# EAGLE design laser-breakout (EAGLE 7.7.0)
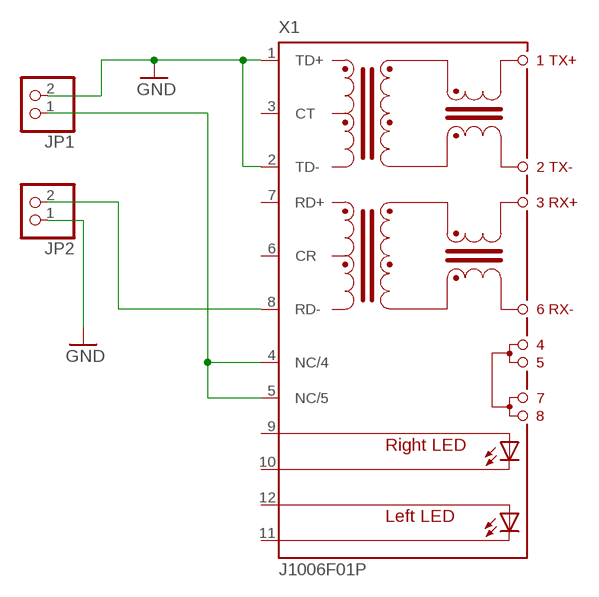
[diagram p0: schematic, sheet 1]

## Parts
JP1  PINHD-1X2  [1X02]
JP2  PINHD-1X2  [1X02]
X1  J1006F01P  [J1]

## Nets
12V: JP1.1 X1.4(NC/4) X1.5(NC/5)
GND: JP1.2 JP2.1 X1.1(TD+) X1.2(TD-)
TTL: JP2.2 X1.8(RD-)
Unconnected: X1.3(CT) X1.6(CR) X1.7(RD+) X1.9(A-R) X1.10(C-R) X1.11(C-L) X1.12(A-L)

## Library data of the parts
JP1 JP2 = pinhead:PINHD-1X2: PIN HEADER
X1 = con-pulse:J1006F01P: PULSEJACK (TM) 1x1 Tab-UP RJ45 10/100 Base-TX RJ45 1x1 Tab-UP with LEDs 8-pin (J1 series) and 6-pin (JP series) integrated magnetics connector, designed to support applications, such as ADSL modems, LAN-on-Motherboard, and Hub and Switches. Source: www.pulseeng.com .. PulseJack-J402.pdf; OC_FARNELL: unknown; OC_NEWARK: unknown

## Board
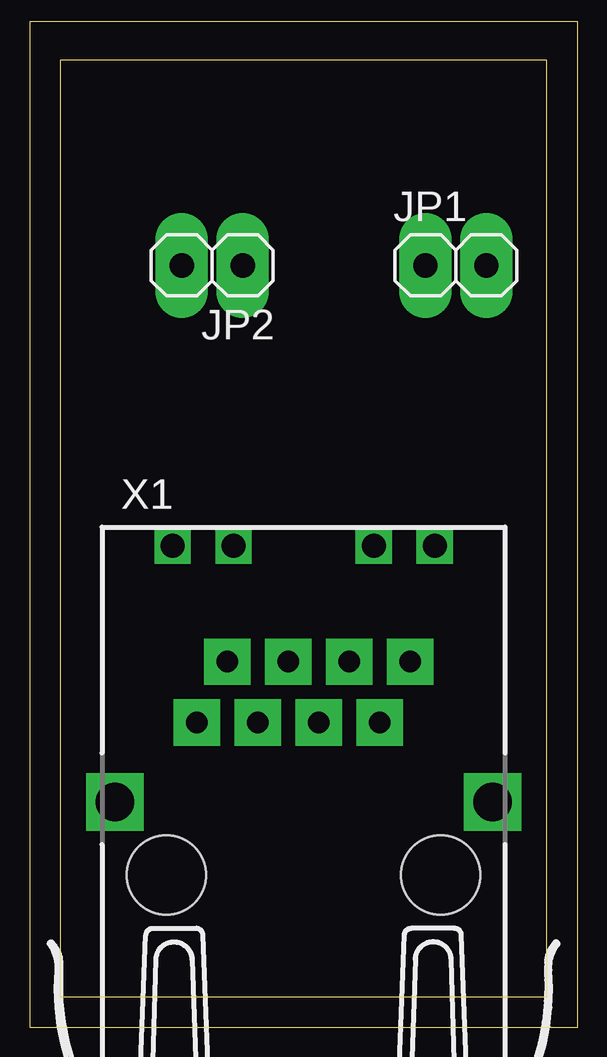
[diagram p1: board, top side]
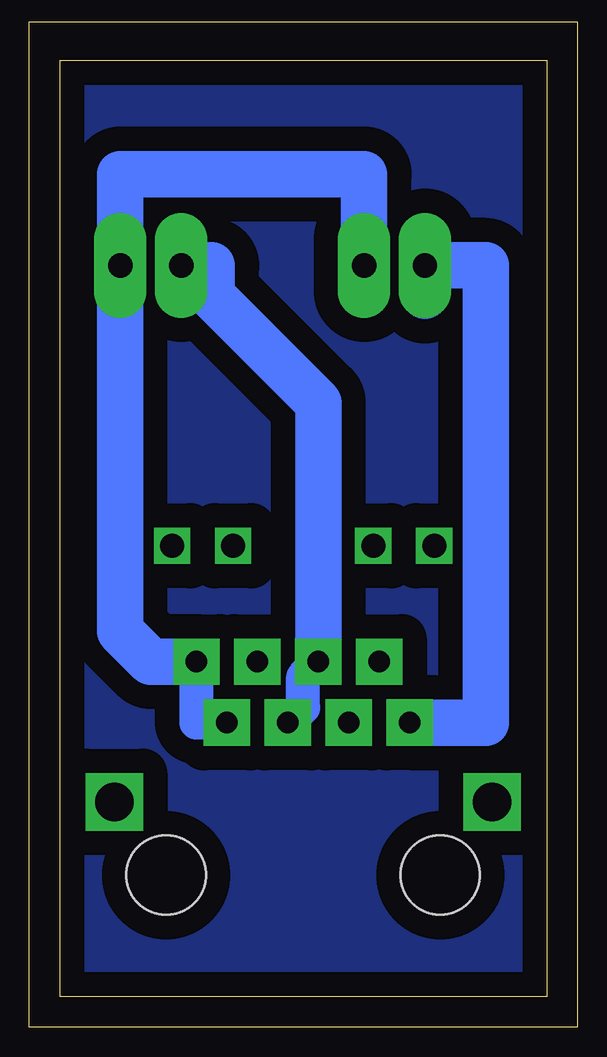
[diagram p2: board, bottom side, seen from below]

Size 20.3 x 39.04 mm. Coordinates in mm from the lower left corner, seen from the top.
Outline: 0,0 20.3,0 20.3,39.04 0,39.04 0,0
Copper layers (1*16): Top 0.035mm / dielectric 1.5mm / Bottom 0.035mm
Design rules "default": minimum track width 10mil, minimum drill 24mil, track to track 8mil, track to pad 8mil, pad to pad 8mil, via to via 8mil, smd to smd 8mil, copper to edge 40mil, drill to drill 8mil, minimum pad ring 10mil, minimum via ring 8mil, stop-mask expansion 4mil, vias tented up to drill 0mil, thermal gap 10mil
Milling: 4 lines

### Footprints (pad centres in the part's own frame; a part is rotated, then mirrored left to right if it is on the bottom)
1X02 = drill 1.016 pad 2.184 long: 1 -1.27,0; 2 1.27,0
J1 = drill 0.9 pad 1.93 square: 1 4.445,2.54; 2 3.175,0; 3 1.905,2.54; 4 0.635,0; 5 -0.635,2.54; 6 -1.905,0; 7 -3.175,2.54; 8 -4.445,0 | drill 1 pad 1.422 square: 9 5.465,7.37; 10 2.925,7.37; 11 -2.925,7.37; 12 -5.465,7.37 | drill 1.6 pad 2.184 square: M1 -7.875,-3.3; M2 7.875,-3.3 | hole 3.3: 5.715,-6.35; -5.715,-6.35

### Placement (x,y rotation side)
JP1  16.51,30.48 0 top
JP2  6.35,30.48 180 top
X1  10.16,11.43 0 top

### Tracks (layer width: path | path; a pad name or v marks a point on that pad's centre or on a via)
12V
  Bottom 1.422: X1.4 10.16,12.06 10.16,13.34 X1.5
  Bottom 1.93: X1.5 9.53,24.77 13.97,29.21 13.97,30.48 JP1.1
GND
  Bottom 1.422: X1.2 14.61,11.43 X1.1
  Bottom 1.93: JP2.1 7.62,34.29 17.78,34.29 JP1.2 17.78,15.24 16.51,13.97 X1.1
N$1
  pour Bottom (isolate 1.016): 0,39.37 0,0 20.32,0 20.32,39.37
TTL
  Bottom 1.93: X1.8 2.54,11.43 2.54,30.48 JP2.2 5.08,29.21